# Altium schematic sheet 1V8&1V2_DCDC_Convertor.SchDoc: 1V8&1V2 DCDC Convertor
size A4
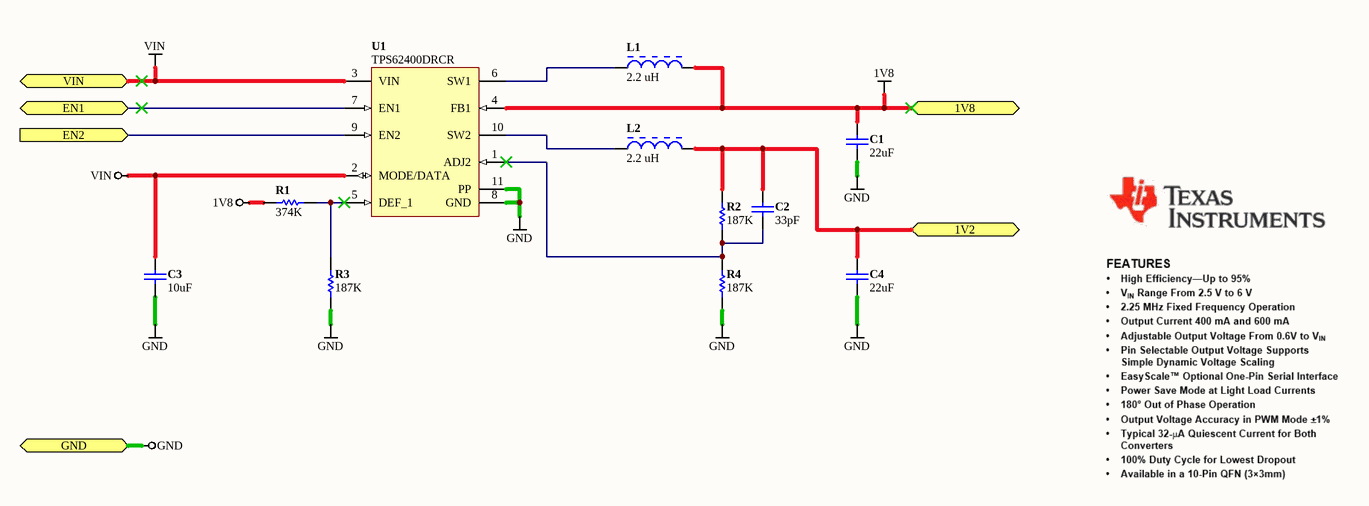
[diagram p0: 1V8&1V2_DCDC_Convertor.SchDoc]

## Parts
C1  value 22uF  [CAPC0805(2012)145_L]  (hidden comment: CAP 22uF 10V 0805(2012))
C2  value 33pF  [CAPC0402(1005)60_L]  (hidden comment: CAP 33pF 16V 0402(1005))
C3  value 10uF  [CAPC0603(1608)100_N]  (hidden comment: CAP 10uF 10V 0603(1608))
C4  value 22uF  [CAPC0805(2012)145_L]  (hidden comment: CAP 22uF 10V 0805(2012))
L1  Inductance: 2.2 uH  [BOUR-SRU2013-2R2Y-2_V]  (hidden comment: SRU2013-2R2Y)
L2  Inductance: 2.2 uH  [BOUR-SRU2013-2R2Y-2_V]  (hidden comment: SRU2013-2R2Y)
R1  374K  [RESC0402(1005)_M]
R2  187K  [RESC0402(1005)_M]
R3  187K  [RESC0402(1005)_M]
R4  187K  [RESC0402(1005)_M]
U1  TPS62400DRCR  [DRC10-2400X1650TP]

## Ports
1V2, 1V8, EN1, EN2 (in), GND, VIN

## Nets
1V8: C1.2 L1.2 R1.2 U1.4(FB1) ; port 1V8
GND: C1.1 C3.1 C4.1 R3.1 R4.1 U1.8(GND) U1.11(PP) ; port GND
VIN: C3.2 U1.2(MODE/DATA) U1.3(VIN) ; port VIN
1V2: C2.2 C4.2 L2.2 R2.2 ; port 1V2
EN1: U1.7(EN1) ; port EN1
EN2: U1.9(EN2) ; port EN2
NetC2_1: C2.1 R2.1 R4.2 U1.1(ADJ2)
NetL1_1: L1.1 U1.6(SW1)
NetL2_1: L2.1 U1.10(SW2)
NetR1_1: R1.1 R3.2 U1.5(DEF_1)

## Notes on the sheet
- Sheet Title
- Project Title
- Size:
- Date:
- A4
- Item:
- Time:
- Revision:
- Sheet
- of
- File:

## Library data of the parts
C1 C4 = CMP-1036-04942-1: CAP 22uF 10V ±10% 0805 (2012 Metric) Thickness 1.45mm SMD; Case-EIA: 0805; Case-Metric: 2012; Rated Voltage: 10 V; Max Thickness: 1.45 mm; Technology: SMT; Tolerance: ±10%
C2 = CMP-1034-00991-1: CAP 33pF 16V ±1% 0402 (1005 Metric) Thickness 0.6mm SMD; Case-Metric: 1005; Case-EIA: 0402; Rated Voltage: 16 V; Max Thickness: 0.6 mm; Tolerance: ±1%; Technology: SMT
C3 = CMP-1035-02799-1: CAP 10uF 10V ±10% 0603 (1608 Metric) Thickness 1mm SMD; Case-Metric: 1608; Case-EIA: 0603; Max Thickness: 1 mm; Tolerance: ±10%; Technology: SMT; Rated Voltage: 10 V
L1 L2 = CMP-0462-00001-1: Power Inductor, 2.2 uH, 1.45 Irms Max(A), SMD; Manufacturer: Bourns; Frequency - Self Resonant: 100 MHz; Current - Saturation: 950 mA; Current Rating: 1.45 A; DC Resistance (DCR): 120 mOhm Max; Tolerance: +/-30%; PackageReference: SRU2013-2R2Y-2; PackageDescription: 2-Pin Hand Drawn, Body 2.8 x 2.8 mm; ComponentLink3URL: http://www.bourns.com/data/global/pdfs/SRU2013.pdf; ComponentLink3Description: Package Specification; Operating Temperature: -40 to 125 degC; ComponentLink2Description: Datasheet; ComponentLink2URL: http://www.bourns.com/data/global/pdfs/SRU2013.pdf; Mounting Technology: Surface Mount; PartNumber: SRU2013-2R2Y; DatasheetVersion: 2/13/2013; ComponentLink1Description: Manufacturer URL; ComponentLink1URL: http://www.bourns.com
R1 = CMP-1011-00800-1: 374K 0.063W 1% 0402 (1005 Metric)  SMD; Case-EIA: 0402; Value: 374000.00 Ohm; Case-Metric: 1005; Technology: SMT; Power: 0.063 W; Tolerance: 1 %
R2-R4 = CMP-1011-00765-1: 187K 0.063W 1% 0402 (1005 Metric)  SMD; Case-Metric: 1005; Value: 187000.00 Ohm; Case-EIA: 0402; Technology: SMT; Tolerance: 1 %; Power: 0.063 W
U1 = CMP-0323-00305-2: Buck Adjustable Regulator with 2.5 to 6 V Input and 0.6 to 6 V Output, -40 to 85 degC, 10-Pin SON (DRC), Green (RoHS & no Sb/Br); Manufacturer: Texas Instruments; Rating: Catalog; Vin(Min)(V): 2.5; Vout(Max)(V): 6; Dynamic Voltage Scaling: TRUE; Regulated Outputs(#): 2; Vout2(Min)(V): 0.6; Switch Current Limit(Typ)(A): 1; Iq(Typ)(mA): 0.032; SubFamily: Step-Down Regulator; Duty Cycle(Max)(%): 100; Iout(Max)(A): 0.4; PackageDescription: 10-Pin Plastic Small Outline No-Lead, 3 x 3 x 1 mm Body, 0.5 mm Pitch, Exposed Pad; PackageVersion: revL, Sep-2011; ComponentLink1URL: http://www.ti.com/general/docs/lit/getliterature.tsp?genericPartNumber=TPS62400&fileType=pdf; ComponentLink2Description: Package Specification; PartNumber: TPS62400DRCR; DatasheetVersion: SLVS681E; ComponentLink1Description: Datasheet; ComponentLink3URL: Samples URL:http://www.ti.com/product/tps62400#samples; Vout2(Max)(V): 6; Vin(Max)(V): 6; Eco-Plan: Green (RoHS & no Sb/Br); Topology: Buck; PackageReference: DRC10-2400X1650TP; Iout2(Max)(A): 0.6; Vout(Min)(V): 0.6; Synchronous Rectification: TRUE; ComponentLink3Description: URL Link1; Mounting Technology: Surface Mount; ComponentLink2URL: http://www.ti.com/litv/pdf/mpds117k